# EAGLE schematic TRIWHEEL (EAGLE 9.5.1)
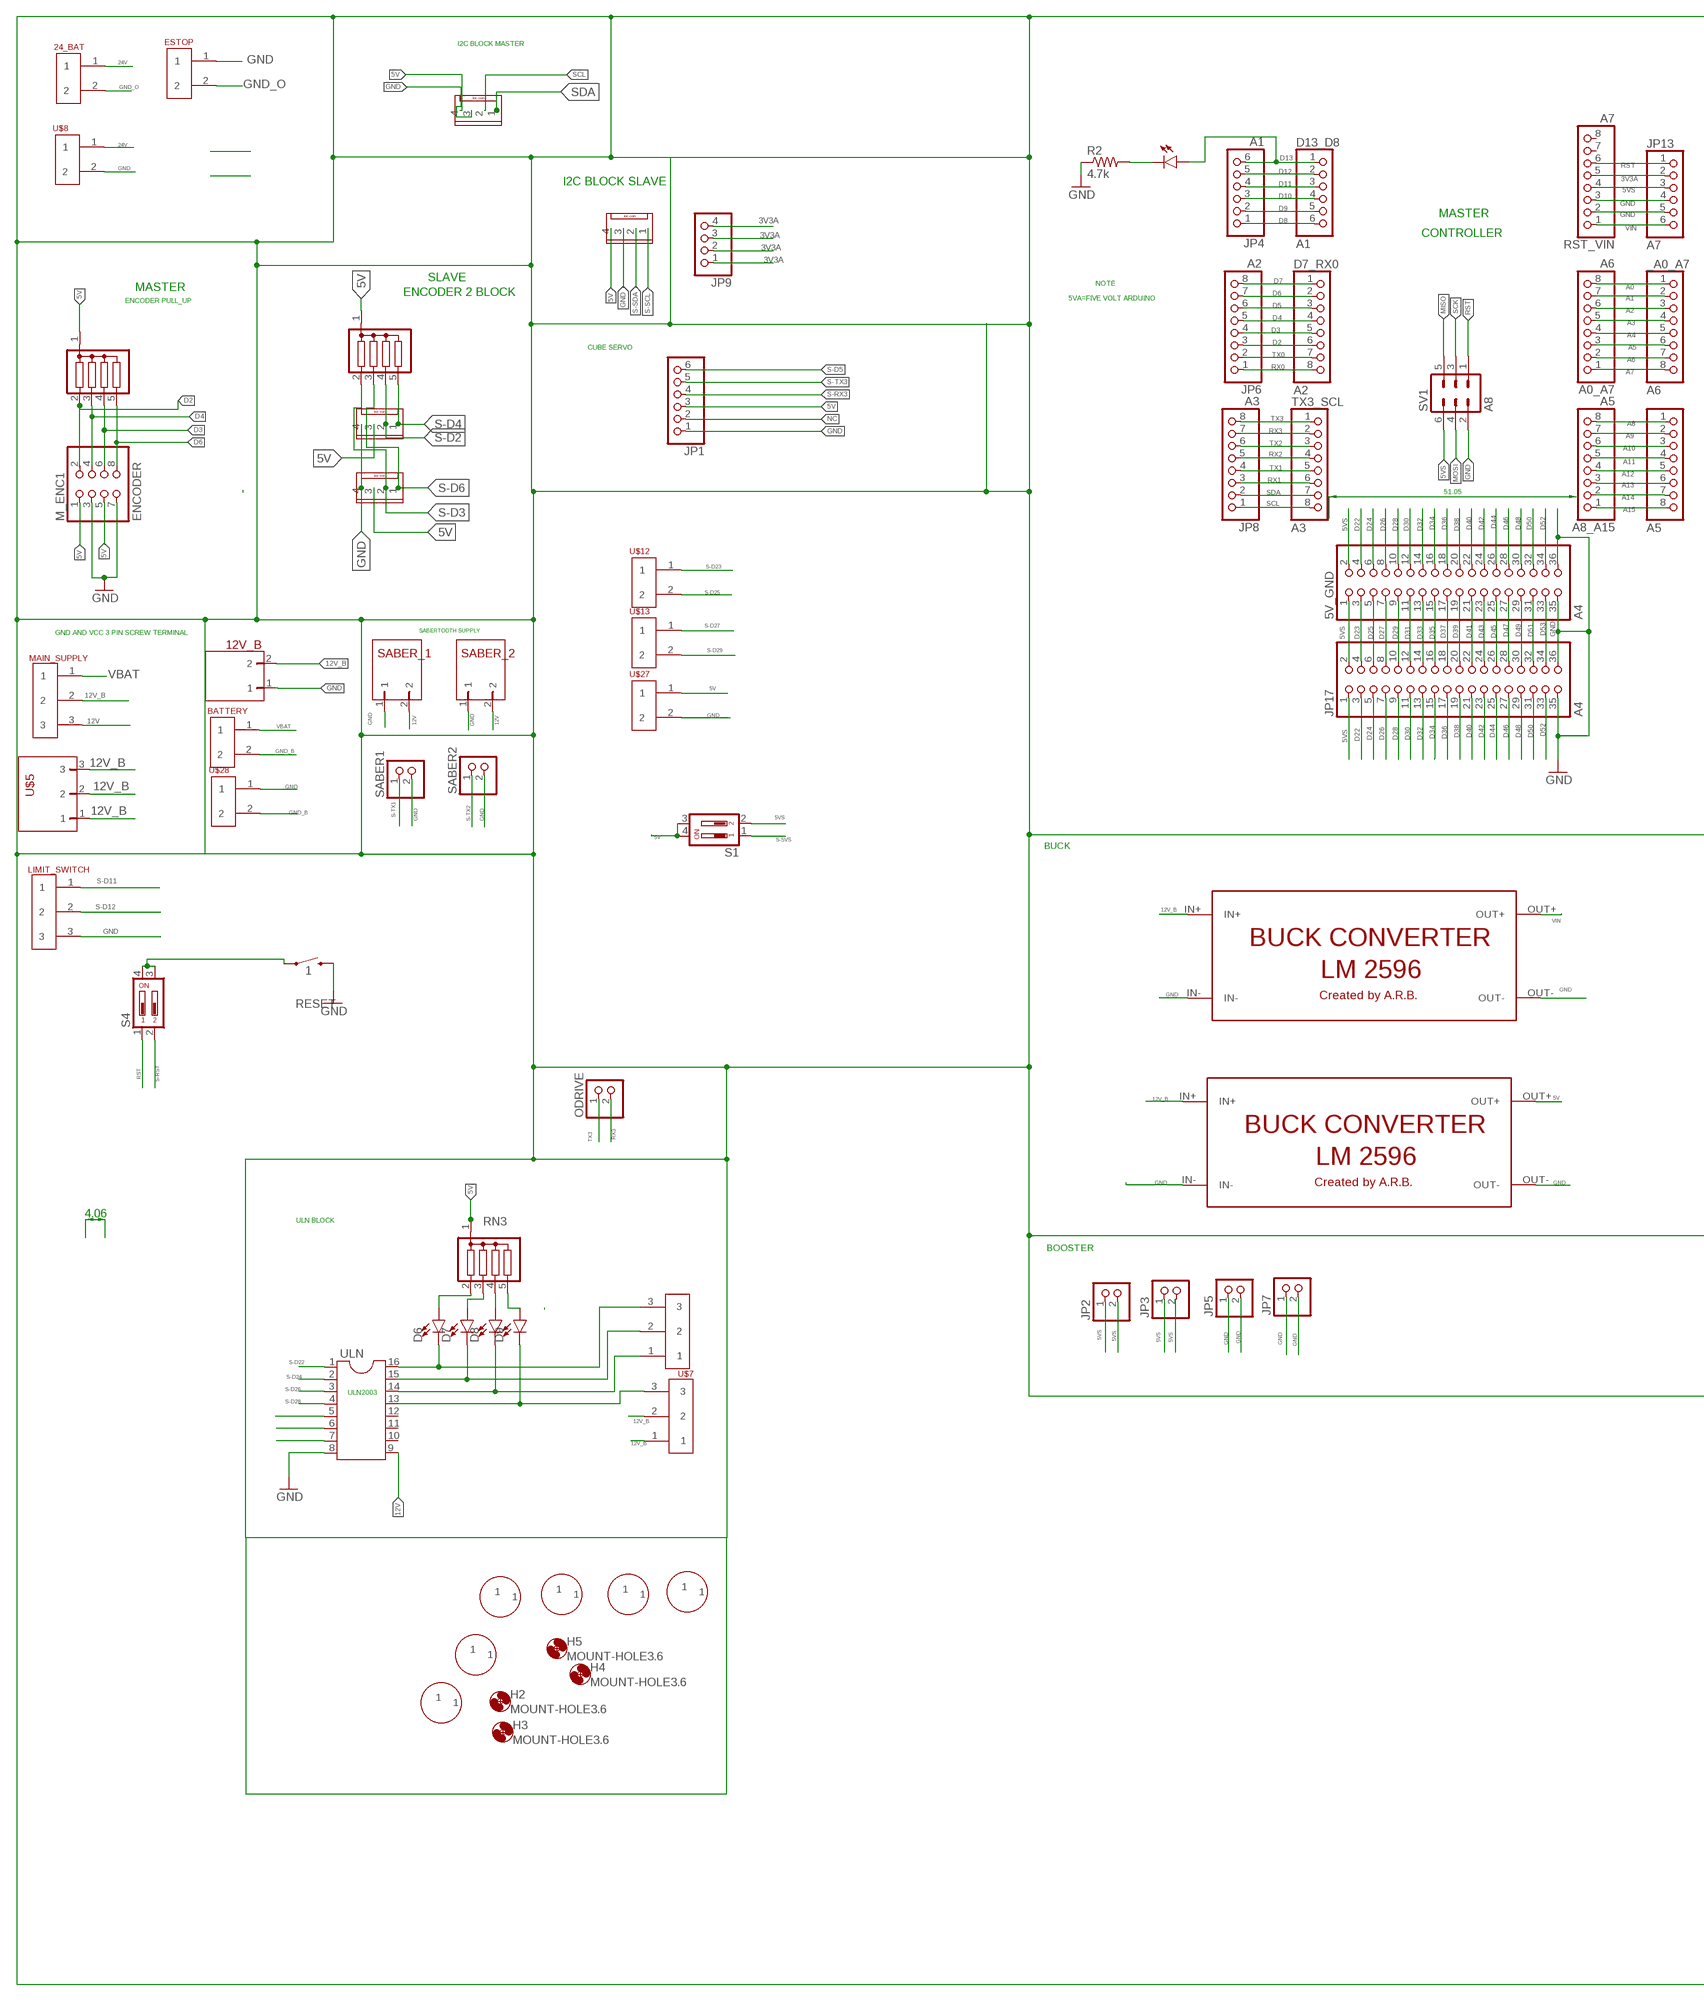
[diagram p0: schematic, sheet 1, part 1 of 2]
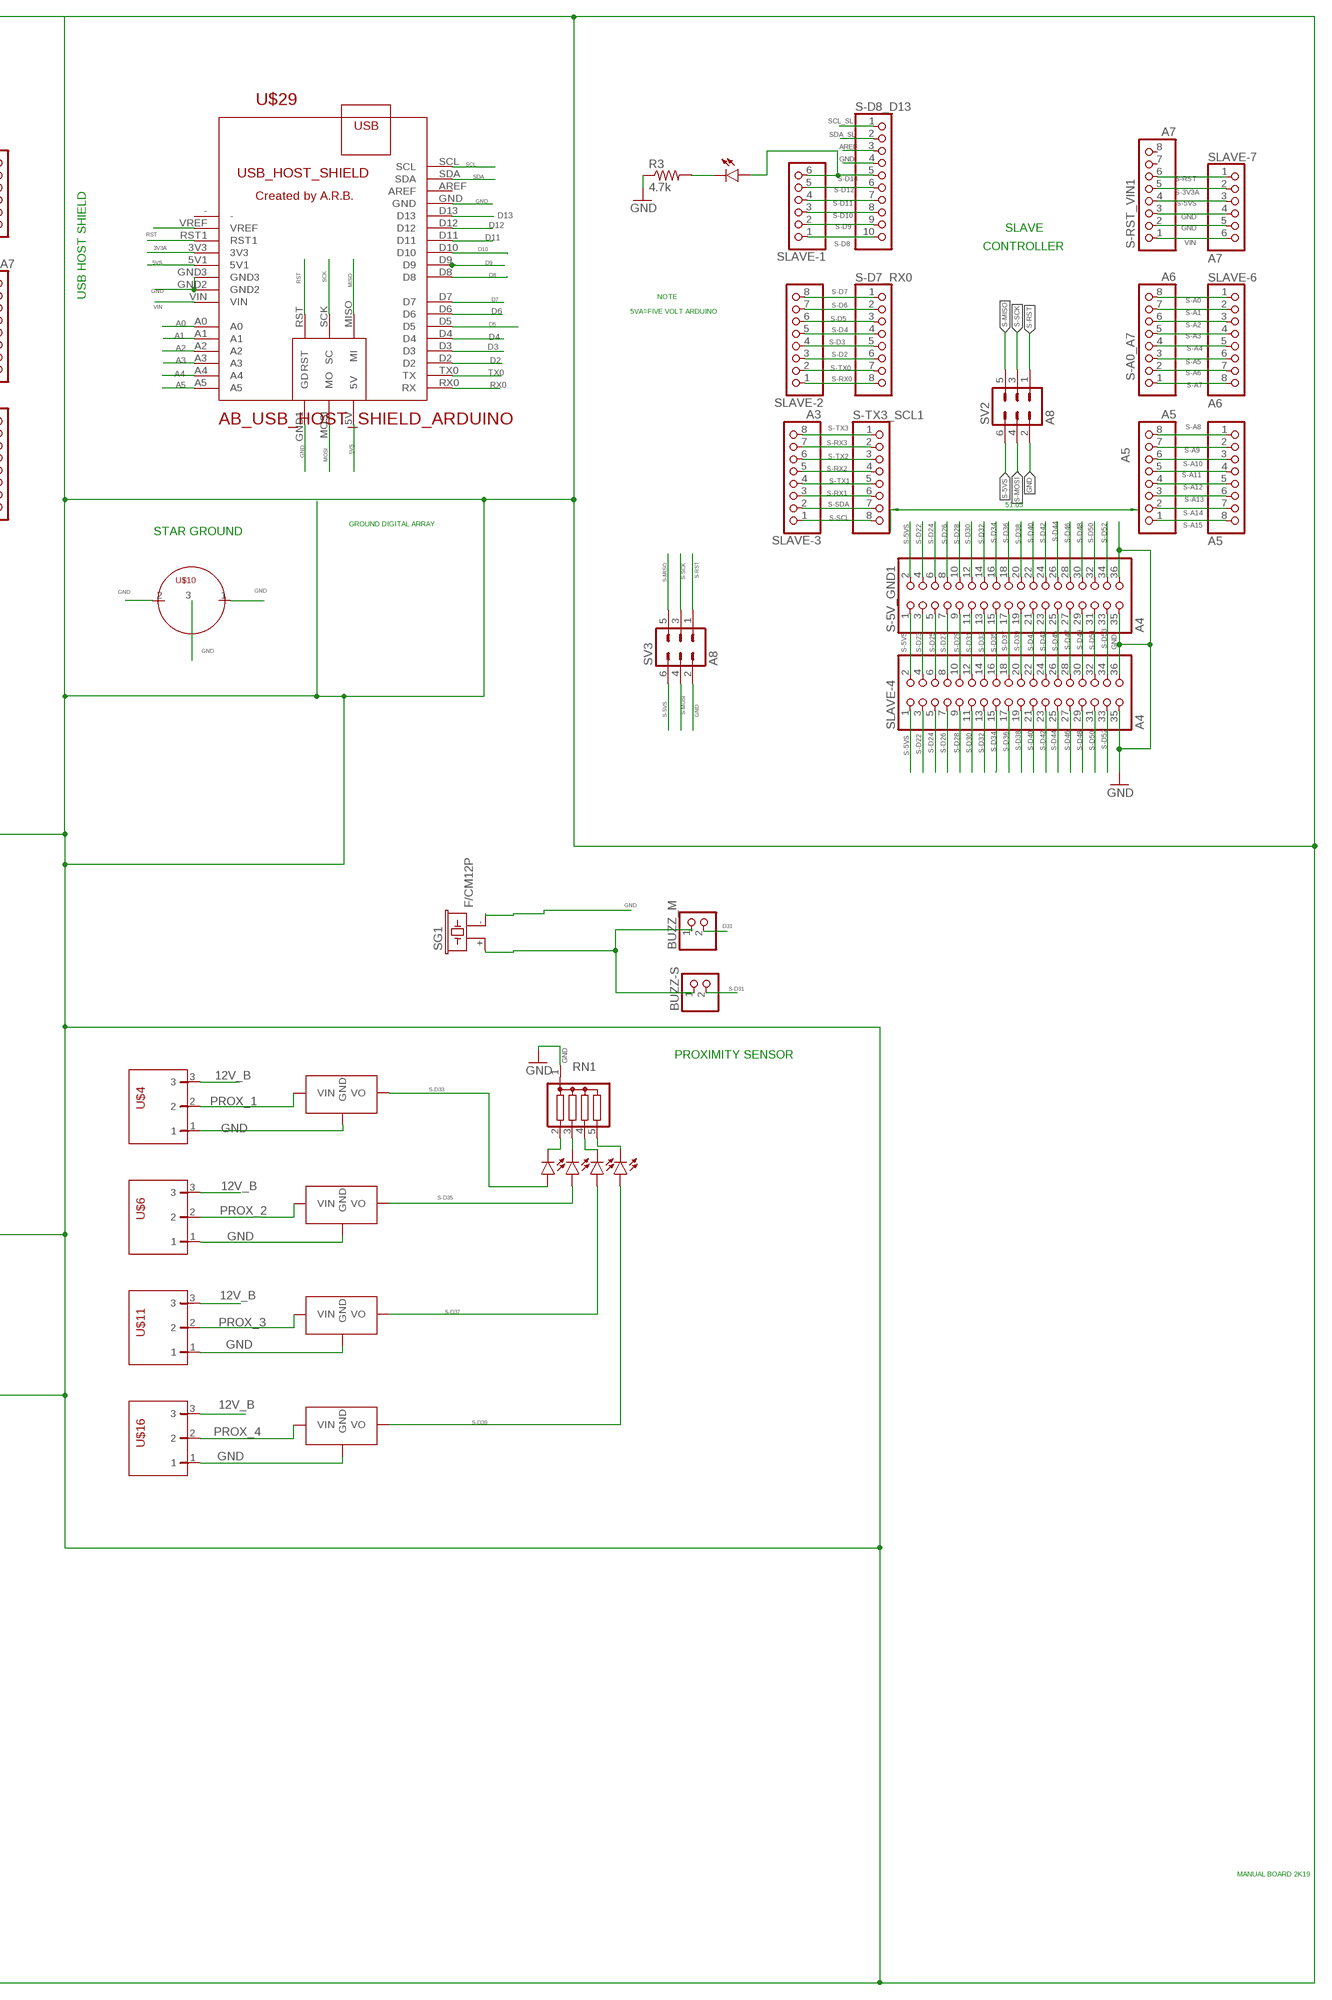
[diagram p1: schematic, sheet 1, part 2 of 2]

## Parts
5V_GND  A4  PINHD-2X18  [2X18]
12V_B  AB_RIGHT_TER_BLK  [AB_RIGHT_TER_BLK]
24_BAT  AB_SCREW_TERMINAL_5MM_2PIN  [AB_SCREW_TERMINAL_5MM_2PIN]
_A0_A7  A6  PINHD-1X8  [1X08]
A0_A7  A6  PINHD-1X8  [1X08]
A5  A5  PINHD-1X8  [1X08]
A8_A15  A5  PINHD-1X8  [1X08]
BATTERY  AB_SCREW_TERMINAL_5MM_2PIN  [AB_SCREW_TERMINAL_5MM_2PIN]
BUZZ-S  PINHD-1X2  [1X02]
BUZZ_M  PINHD-1X2  [1X02]
D1  LED-3MM-NO_SILK  [LED_3MM-NS]
D2  LED-3MM-NO_SILK  [LED_3MM-NS]
D3  LED-3MM-NO_SILK  [LED_3MM-NS]
D4  LED-3MM-NO_SILK  [LED_3MM-NS]
D5  LED-3MM-NO_SILK  [LED_3MM-NS]
D6  LED-3MM-NO_SILK  [LED_3MM-NS]
D7  LED-3MM-NO_SILK  [LED_3MM-NS]
D7_RX0  A2  PINHD-1X8  [1X08]
D8  LED-3MM-NO_SILK  [LED_3MM-NS]
D9  LED-3MM-NO_SILK  [LED_3MM-NS]
D13  LED-3MM-NO_SILK  [LED_3MM-NS]
D13_D8  A1  PINHD-1X6  [1X06]
ESTOP  AB_SCREW_TERMINAL_5MM_2PIN  [AB_SCREW_TERMINAL_5MM_2PIN]
H2  MOUNT-HOLE3.6  [3,6]
H3  MOUNT-HOLE3.6  [3,6]
H4  MOUNT-HOLE3.6  [3,6]
H5  MOUNT-HOLE3.6  [3,6]
IMU_BLOCK  AB_4PIN_LOC_CONNECTOR  [AB_4PIN_LOC_CONNECTOR]
IMU_BLOCK-M  AB_4PIN_LOC_CONNECTOR  [AB_4PIN_LOC_CONNECTOR]
JP  A5  PINHD-1X8  [1X08]
JP1  PINHD-1X6  [1X06]
JP2  PINHD-1X2  [1X02]
JP3  PINHD-1X2  [1X02]
JP4  A1  PINHD-1X6  [1X06]
JP5  PINHD-1X2  [1X02]
JP6  A2  PINHD-1X8  [1X08]
JP7  PINHD-1X2  [1X02]
JP8  A3  PINHD-1X8  [1X08]
JP9  PINHD-1X4  [1X04]
JP13  A7  PINHD-1X6  [1X06]
JP17  A4  PINHD-2X18  [2X18]
LIMIT_SWITCH  AB_SCREW_TER_5MM_3PIN  [AB_SCREW_TER_5MM_3PIN]
M_ENC1  ENCODER  PINHD-2X4  [2X04]
MAIN_SUPPLY  AB_SCREW_TER_5MM_3PIN  [AB_SCREW_TER_5MM_3PIN]
MAIN_SUPPLY1  AB_SCREW_TER_5MM_3PIN  [AB_SCREW_TER_5MM_3PIN]
ODRIVE  PINHD-1X2  [1X02]
PULL_RESISTOR-M  G04R  [SIL5]
R2  4.7k  R-US_0204/7  [0204/7]
R3  4.7k  R-US_0204/7  [0204/7]
RESET  1  MOMENTARY-SWITCH-SPST-PTH-6.0MM  [TACTILE_SWITCH_PTH_6.0MM]
RN1  G04R  [SIL5]
RN3  G04R  [SIL5]
RST_VIN  A7  PINHD-1X8  [1X08]
S1  DIP02YL  [DIP02YL]
S4  DIP02YL  [DIP02YL]
S-5V_GND1  A4  PINHD-2X18  [2X18]
S-A0_A7  A6  PINHD-1X8  [1X08]
S-D7_RX0  A2  PINHD-1X8  [1X08]
S-D8_D13  PINHD-1X10  [1X10]
S-ENC  G04R  [SIL5]
S-RST_VIN1  A7  PINHD-1X8  [1X08]
S-TX3_SCL1  A3  PINHD-1X8  [1X08]
S_A8_A15  A5  PINHD-1X8  [1X08]
SABER1  PINHD-1X2  [1X02]
SABER2  PINHD-1X2  [1X02]
SABER_1  AB_RIGHT_TER_BLK  [AB_RIGHT_TER_BLK]
SABER_2  AB_RIGHT_TER_BLK  [AB_RIGHT_TER_BLK]
SG1  F/CM12P  [F/CM12P]
SLAVE-1  A1  PINHD-1X6  [1X06]
SLAVE-2  A2  PINHD-1X8  [1X08]
SLAVE-3  A3  PINHD-1X8  [1X08]
SLAVE-4  A4  PINHD-2X18  [2X18]
SLAVE-6  A6  PINHD-1X8  [1X08]
SLAVE-7  A7  PINHD-1X6  [1X06]
SV1  A8  MA03-2  [MA03-2]
SV2  A8  MA03-2  [MA03-2]
SV3  A8  MA03-2  [MA03-2]
TX3_SCL  A3  PINHD-1X8  [1X08]
U$1  AB_LM2596_BUCK_CONVERTER  [AB_LM2596_BUCK_CONVERTER]
U$2  AB_LM2596_BUCK_CONVERTER  [AB_LM2596_BUCK_CONVERTER]
U$4  AB_RIGHT_TER_BLK_3PIN  [AB_RIGHT_TER_BLK_3PIN]
U$5  AB_RIGHT_TER_BLK_3PIN  [AB_RIGHT_TER_BLK_3PIN]
U$6  AB_RIGHT_TER_BLK_3PIN  [AB_RIGHT_TER_BLK_3PIN]
U$7  AB_SCREW_TER_5MM_3PIN  [AB_SCREW_TER_5MM_3PIN]
U$8  AB_SCREW_TERMINAL_5MM_2PIN  [AB_SCREW_TERMINAL_5MM_2PIN]
U$9  AB_PLATED_DRILL_160MIL  [AB_PLATED_DRILL_160MIL]
U$10  AB_JOINT_GND  [AB_JOINT_GND]
U$11  AB_RIGHT_TER_BLK_3PIN  [AB_RIGHT_TER_BLK_3PIN]
U$12  AB_SCREW_TERMINAL_5MM_2PIN  [AB_SCREW_TERMINAL_5MM_2PIN]
U$13  AB_SCREW_TERMINAL_5MM_2PIN  [AB_SCREW_TERMINAL_5MM_2PIN]
U$15  AB_PLATED_DRILL_160MIL  [AB_PLATED_DRILL_160MIL]
U$16  AB_RIGHT_TER_BLK_3PIN  [AB_RIGHT_TER_BLK_3PIN]
U$17  AB_7805_FLAT  [AB_7805_FLAT]
U$18  AB_7805_FLAT  [AB_7805_FLAT]
U$19  AB_7805_FLAT  [AB_7805_FLAT]
U$20  AB_7805_FLAT  [AB_7805_FLAT]
U$21  en1  AB_4PIN_LOC_CONNECTOR  [AB_4PIN_LOC_CONNECTOR]
U$22  en2  AB_4PIN_LOC_CONNECTOR  [AB_4PIN_LOC_CONNECTOR]
U$23  AB_PLATED_DRILL_160MIL  [AB_PLATED_DRILL_160MIL]
U$24  AB_PLATED_DRILL_160MIL  [AB_PLATED_DRILL_160MIL]
U$25  AB_PLATED_DRILL_160MIL  [AB_PLATED_DRILL_160MIL]
U$26  AB_PLATED_DRILL_160MIL  [AB_PLATED_DRILL_160MIL]
U$27  AB_SCREW_TERMINAL_5MM_2PIN  [AB_SCREW_TERMINAL_5MM_2PIN]
U$28  AB_SCREW_TERMINAL_5MM_2PIN  [AB_SCREW_TERMINAL_5MM_2PIN]
U$29  AB_USB_HOST_SHIELD_ARDUINO  [AB_USB_HOST_SHIELD_ARDUINO]
ULN  DIL16  [DIL16]

## Nets
3V3A [nrf]: JP9.1 JP9.2 JP9.3 JP9.4 JP13.2 RST_VIN.5 U$29.3V3
5V [5v]: IMU_BLOCK-M.4 IMU_BLOCK.4 JP1.3 M_ENC1.1 M_ENC1.5 PULL_RESISTOR-M.1 RN3.1 S1.3 S1.4 S-ENC.1 U$2.OUT+ U$21.3 U$22.3 U$27.1
5VS [signal]: 5V_GND.1 5V_GND.2 JP2.1 JP2.2 JP3.1 JP3.2 JP13.3 JP17.1 JP17.2 RST_VIN.4 S1.2 SV1.6 U$29.5V U$29.5V1
12V: MAIN_SUPPLY.3 SABER_1.2 SABER_2.2 ULN.9
12V_B: 12V_B.2 MAIN_SUPPLY1.1 MAIN_SUPPLY1.2 MAIN_SUPPLY.2 U$1.IN+ U$2.IN+ U$4.3 U$5.1 U$5.2 U$5.3 U$6.3 U$11.3 U$16.3
24V: 24_BAT.1 U$8.1
A0 [arduino]: _A0_A7.1 A0_A7.8 U$29.A0
A1 [arduino]: _A0_A7.2 A0_A7.7 U$29.A1
A2 [arduino]: _A0_A7.3 A0_A7.6 U$29.A2
A3 [arduino]: _A0_A7.4 A0_A7.5 U$29.A3
A4 [arduino]: _A0_A7.5 A0_A7.4 U$29.A4
A5 [arduino]: _A0_A7.6 A0_A7.3 U$29.A5
A6 [arduino]: _A0_A7.7 A0_A7.2
A7 [arduino]: _A0_A7.8 A0_A7.1
A8 [arduino]: A8_A15.8 JP.1
A9 [arduino]: A8_A15.7 JP.2
A10 [arduino]: A8_A15.6 JP.3
A11 [arduino]: A8_A15.5 JP.4
A12 [arduino]: A8_A15.4 JP.5
A13 [arduino]: A8_A15.3 JP.6
A14 [arduino]: A8_A15.2 JP.7
A15 [arduino]: A8_A15.1 JP.8
AREF [signal-2]: S-D8_D13.3
D2 [arduino]: D7_RX0.6 JP6.3 M_ENC1.2 PULL_RESISTOR-M.2 U$29.D2
D3 [arduino]: D7_RX0.5 JP6.4 M_ENC1.6 PULL_RESISTOR-M.4 U$29.D3
D4 [arduino]: D7_RX0.4 JP6.5 M_ENC1.4 PULL_RESISTOR-M.3 U$29.D4
D5 [arduino]: D7_RX0.3 JP6.6 U$29.D5
D6 [arduino]: D7_RX0.2 JP6.7 M_ENC1.8 PULL_RESISTOR-M.5 U$29.D6
D7 [arduino]: D7_RX0.1 JP6.8 U$29.D7
D8 [arduino]: D13_D8.6 JP4.1 U$29.D8
D9 [arduino]: D13_D8.5 JP4.2 U$29.D9
D10 [arduino]: D13_D8.4 JP4.3 U$29.D10
D11 [arduino]: D13_D8.3 JP4.4 U$29.D11
D12 [arduino]: D13_D8.2 JP4.5 U$29.D12
D13 [arduino]: D13.A D13_D8.1 JP4.6 U$29.D13
D22 [signal]: 5V_GND.4 JP17.3
D23 [arduino]: 5V_GND.3 JP17.4
D24 [signal]: 5V_GND.6 JP17.5
D25 [signal]: 5V_GND.5 JP17.6
D26 [signal]: 5V_GND.8 JP17.7
D27 [signal]: 5V_GND.7 JP17.8
D28 [signal]: 5V_GND.10 JP17.9
D29 [arduino]: 5V_GND.9 JP17.10
D30 [signal]: 5V_GND.12 JP17.11
D31 [arduino]: 5V_GND.11 BUZZ_M.2 JP17.12
D32 [signal]: 5V_GND.14 JP17.13
D33 [arduino]: 5V_GND.13 JP17.14
D34 [signal]: 5V_GND.16 JP17.15
D35 [arduino]: 5V_GND.15 JP17.16
D36 [signal]: 5V_GND.18 JP17.17
D37 [arduino]: 5V_GND.17 JP17.18
D38 [signal]: 5V_GND.20 JP17.19
D39 [arduino]: 5V_GND.19 JP17.20
D40 [signal]: 5V_GND.22 JP17.21
D41 [arduino]: 5V_GND.21 JP17.22
D42 [signal]: 5V_GND.24 JP17.23
D43 [arduino]: 5V_GND.23 JP17.24
D44 [signal]: 5V_GND.26 JP17.25
D45 [arduino]: 5V_GND.25 JP17.26
D46 [signal]: 5V_GND.28 JP17.27
D47 [arduino]: 5V_GND.27 JP17.28
D48 [signal]: 5V_GND.30 JP17.29
D49 [signal]: 5V_GND.29 JP17.30
D50 [signal]: 5V_GND.32 JP17.31
D51 [signal]: 5V_GND.31 JP17.32
D52 [signal]: 5V_GND.34 JP17.33
D53 [signal]: 5V_GND.33 JP17.34
GND: 5V_GND.35 5V_GND.36 12V_B.1 ESTOP.1 IMU_BLOCK-M.3 IMU_BLOCK.3 JP1.1 JP5.1 JP5.2 JP7.1 JP7.2 JP13.4 JP13.5 JP17.35 JP17.36 LIMIT_SWITCH.3 M_ENC1.3 M_ENC1.7 R2.1 R3.1 RESET.3 RN1.1 RST_VIN.2 RST_VIN.3 S-5V_GND1.35 S-5V_GND1.36 S-D8_D13.4 S-RST_VIN1.2 S-RST_VIN1.3 SABER1.2 SABER2.2 SABER_1.1 SABER_2.1 SG1.- SLAVE-4.35 SLAVE-4.36 SLAVE-7.4 SLAVE-7.5 SV1.2 SV2.2 SV3.2 U$1.IN- U$1.OUT- U$2.IN- U$2.OUT- U$4.1 U$6.1 U$8.2 U$10.1 U$10.2 U$10.3 U$11.1 U$16.1 U$17.2(GND) U$18.2(GND) U$19.2(GND) U$20.2(GND) U$21.4 U$22.4 U$27.2 U$28.1 U$29.GND U$29.GND1(GD) U$29.GND2 U$29.GND3 ULN.8
GND_B: BATTERY.2 U$28.2
GND_O [odrive]: 24_BAT.2 ESTOP.2
MISO [signal]: SV1.5 U$29.MISO(MI)
MOSI [signal]: SV1.4 U$29.MOSI(MO)
N$2: D5.K(C) R3.2
N$3 [signal-3]: BUZZ-S.1 BUZZ_M.1 SG1.+
N$5: D1.K(C) RN1.2
N$6: D2.K(C) RN1.3
N$7 [signal-3]: D6.K(C) U$7.3 ULN.16
N$8 [signal-3]: D7.K(C) U$7.2 ULN.15
N$9 [signal-3]: D8.K(C) U$7.1 ULN.14
N$10 [signal-3]: D9.K(C) MAIN_SUPPLY1.3 ULN.13
N$12 [signal-1]: D6.A RN3.2
N$13 [signal-1]: D7.A RN3.3
N$14 [signal-1]: D8.A RN3.4
N$15 [signal-1]: D9.A RN3.5
N$16 [signal-3]: RESET.1 S4.3 S4.4
N$19: U$29.VREF
N$20: D3.K(C) RN1.4
N$21: D4.K(C) RN1.5
N$32 [signal-1]: ULN.5
N$33 [signal-1]: ULN.6
N$34 [signal-1]: ULN.7
N$140 [signal]: D13.K(C) R2.2
NC: JP1.2
PROX_1: U$4.2 U$17.1(VIN)
PROX_2: U$6.2 U$18.1(VIN)
PROX_3: U$11.2 U$19.1(VIN)
PROX_4: U$16.2 U$20.1(VIN)
RST [arduino]: JP13.1 RST_VIN.6 S4.1 SV1.1 U$29.RST U$29.RST1
RX0 [arduino]: D7_RX0.8 JP6.1 U$29.RX0(RX)
RX1 [arduino]: JP8.3 TX3_SCL.6
RX2 [arduino]: JP8.5 TX3_SCL.4
RX3 [arduino]: JP8.7 ODRIVE.2 TX3_SCL.2
S-3V3A [signal-2]: S-RST_VIN1.5 SLAVE-7.2
S-5VS [signal-2]: S1.1 S-5V_GND1.1 S-5V_GND1.2 S-RST_VIN1.4 SLAVE-4.1 SLAVE-4.2 SLAVE-7.3 SV2.6 SV3.6
S-A0 [signal-2]: S-A0_A7.8 SLAVE-6.1
S-A1 [signal-2]: S-A0_A7.7 SLAVE-6.2
S-A2 [signal-2]: S-A0_A7.6 SLAVE-6.3
S-A3 [signal-2]: S-A0_A7.5 SLAVE-6.4
S-A4 [signal-2]: S-A0_A7.4 SLAVE-6.5
S-A5 [signal-2]: S-A0_A7.3 SLAVE-6.6
S-A6 [signal-2]: S-A0_A7.2 SLAVE-6.7
S-A7 [signal-2]: S-A0_A7.1 SLAVE-6.8
S-A8 [signal-2]: A5.8 S_A8_A15.1
S-A9 [signal-2]: A5.7 S_A8_A15.2
S-A10 [signal-2]: A5.6 S_A8_A15.3
S-A11 [signal-2]: A5.5 S_A8_A15.4
S-A12 [signal-2]: A5.4 S_A8_A15.5
S-A13 [signal-2]: A5.3 S_A8_A15.6
S-A14 [signal-2]: A5.2 S_A8_A15.7
S-A15 [signal-2]: A5.1 S_A8_A15.8
S-D2 [signal-2]: S-D7_RX0.6 S-ENC.4 SLAVE-2.3 U$21.2
S-D3 [signal-2]: S-D7_RX0.5 S-ENC.2 SLAVE-2.4 U$22.2
S-D4 [signal-2]: S-D7_RX0.4 S-ENC.5 SLAVE-2.5 U$21.1
S-D5 [signal-2]: JP1.6 S-D7_RX0.3 SLAVE-2.6
S-D6 [signal-2]: S-D7_RX0.2 S-ENC.3 SLAVE-2.7 U$22.1
S-D7 [signal-2]: S-D7_RX0.1 SLAVE-2.8
S-D8 [signal-2]: S-D8_D13.10 SLAVE-1.1
S-D9 [signal-2]: S-D8_D13.9 SLAVE-1.2
S-D10 [signal-2]: S-D8_D13.8 SLAVE-1.3
S-D11 [signal-2]: LIMIT_SWITCH.1 S-D8_D13.7 SLAVE-1.4
S-D12 [signal-2]: LIMIT_SWITCH.2 S-D8_D13.6 SLAVE-1.5
S-D13 [signal-2]: D5.A S-D8_D13.5 SLAVE-1.6
S-D22 [signal-2]: S-5V_GND1.4 SLAVE-4.3 ULN.1
S-D23 [signal-2]: S-5V_GND1.3 SLAVE-4.4 U$12.1
S-D24 [signal-2]: S-5V_GND1.6 SLAVE-4.5 ULN.2
S-D25 [signal-2]: S-5V_GND1.5 SLAVE-4.6 U$12.2
S-D26 [signal-2]: S-5V_GND1.8 SLAVE-4.7 ULN.3
S-D27 [signal-2]: S-5V_GND1.7 SLAVE-4.8 U$13.1
S-D28 [signal-2]: S-5V_GND1.10 SLAVE-4.9 ULN.4
S-D29 [signal-2]: S-5V_GND1.9 SLAVE-4.10 U$13.2
S-D30 [signal-2]: S-5V_GND1.12 SLAVE-4.11
S-D31 [signal-2]: BUZZ-S.2 S-5V_GND1.11 SLAVE-4.12
S-D32 [signal-2]: S-5V_GND1.14 SLAVE-4.13
S-D33 [signal-2]: D1.A S-5V_GND1.13 SLAVE-4.14 U$17.3(VO)
S-D34 [signal-2]: S-5V_GND1.16 SLAVE-4.15
S-D35 [signal-2]: D2.A S-5V_GND1.15 SLAVE-4.16 U$18.3(VO)
S-D36 [signal-2]: S-5V_GND1.18 SLAVE-4.17
S-D37 [signal-2]: D3.A S-5V_GND1.17 SLAVE-4.18 U$19.3(VO)
S-D38 [signal-2]: S-5V_GND1.20 SLAVE-4.19
S-D39 [signal-2]: D4.A S-5V_GND1.19 SLAVE-4.20 U$20.3(VO)
S-D40 [signal-2]: S-5V_GND1.22 SLAVE-4.21
S-D41 [signal-2]: S-5V_GND1.21 SLAVE-4.22
S-D42 [signal-2]: S-5V_GND1.24 SLAVE-4.23
S-D43 [signal-2]: S-5V_GND1.23 SLAVE-4.24
S-D44 [signal-2]: S-5V_GND1.26 SLAVE-4.25
S-D45 [signal-2]: S-5V_GND1.25 SLAVE-4.26
S-D46 [signal-2]: S-5V_GND1.28 SLAVE-4.27
S-D47 [signal-2]: S-5V_GND1.27 SLAVE-4.28
S-D48 [signal-2]: S-5V_GND1.30 SLAVE-4.29
S-D49 [signal-2]: S-5V_GND1.29 SLAVE-4.30
S-D50 [signal-2]: S-5V_GND1.32 SLAVE-4.31
S-D51 [signal-2]: S-5V_GND1.31 SLAVE-4.32
S-D52 [signal-2]: S-5V_GND1.34 SLAVE-4.33
S-D53 [signal-2]: S-5V_GND1.33 SLAVE-4.34
S-MISO [signal-2]: SV2.5 SV3.5
S-MOSI [signal-2]: SV2.4 SV3.4
S-RST [signal-2]: S4.2 S-RST_VIN1.6 SLAVE-7.1 SV2.1 SV3.1
S-RX0 [signal-2]: S-D7_RX0.8 SLAVE-2.1
S-RX1 [signal-2]: S-TX3_SCL1.6 SLAVE-3.3
S-RX2 [signal-2]: S-TX3_SCL1.4 SLAVE-3.5
S-RX3 [signal-2]: JP1.4 S-TX3_SCL1.2 SLAVE-3.7
S-SCK [signal-2]: SV2.3 SV3.3
S-SCL [signal-2]: IMU_BLOCK.1 S-TX3_SCL1.8 SLAVE-3.1
S-SDA [signal-2]: IMU_BLOCK.2 S-TX3_SCL1.7 SLAVE-3.2
S-TX0 [signal-2]: S-D7_RX0.7 SLAVE-2.2
S-TX1 [signal-2]: S-TX3_SCL1.5 SABER1.1 SLAVE-3.4
S-TX2 [signal-2]: S-TX3_SCL1.3 SABER2.1 SLAVE-3.6
S-TX3 [signal-2]: JP1.5 S-TX3_SCL1.1 SLAVE-3.8
SCK [signal]: SV1.3 U$29.SCK(SC)
SCL [arduino]: IMU_BLOCK-M.2 JP8.1 TX3_SCL.8 U$29.SCL
SCL_SL [signal-2]: S-D8_D13.1
SDA [arduino]: IMU_BLOCK-M.1 JP8.2 TX3_SCL.7 U$29.SDA
SDA_SL [signal-2]: S-D8_D13.2
TX0 [arduino]: D7_RX0.7 JP6.2 U$29.TX0(TX)
TX1 [arduino]: JP8.4 TX3_SCL.5
TX2 [arduino]: JP8.6 TX3_SCL.3
TX3 [arduino]: JP8.8 ODRIVE.1 TX3_SCL.1
VBAT: BATTERY.1 MAIN_SUPPLY.1
VIN [arduino]: JP13.6 RST_VIN.1 S-RST_VIN1.1 SLAVE-7.6 U$1.OUT+ U$29.VIN
Unconnected: RST_VIN.7 RST_VIN.8 S-RST_VIN1.7 S-RST_VIN1.8 U$9.1 U$15.1 U$23.1 U$24.1 U$25.1 U$26.1 U$29.- U$29.AREF ULN.10 ULN.11 ULN.12

## Notes on the sheet
- I2C BLOCK MASTER
- I2C BLOCK SLAVE
- MASTER
- SLAVE
- CONTROLLER
- CONTROLLER
- SLAVE
- NOTE
- MASTER
- ENCODER 2 BLOCK
- 5VA=FIVE VOLT ARDUINO | USB HOST SHIELD | NOTE
- ENCODER PULL_UP
- 5VA=FIVE VOLT ARDUINO
- CUBE SERVO
- GROUND DIGITAL ARRAY
- STAR GROUND
- SABERTOOTH SUPPLY
- GND AND VCC 3 PIN SCREW TERMINAL
- BUCK
- PROXIMITY SENSOR
- ULN BLOCK
- BOOSTER
- ULN2003
- MANUAL BOARD 2K19

## Library data of the parts
5V_GND JP17 S-5V_GND1 SLAVE-4 = pinhead:PINHD-2X18: PIN HEADER
12V_B SABER_1 SABER_2 = AB_Right_angle_terminal_block:AB_RIGHT_TER_BLK
24_BAT BATTERY ESTOP U$8 U$12 U$13 U$27 U$28 = AB_SCREW_TER_5MM_2PIN_BIG:AB_SCREW_TERMINAL_5MM_2PIN
_A0_A7 A0_A7 A5 A8_A15 D7_RX0 JP JP6 JP8 RST_VIN S-A0_A7 S-D7_RX0 S-RST_VIN1 S-TX3_SCL1 S_A8_A15 SLAVE-2 SLAVE-3 SLAVE-6 TX3_SCL = pinhead:PINHD-1X8: PIN HEADER
BUZZ-S BUZZ_M JP2 JP3 JP5 JP7 ODRIVE SABER1 SABER2 = pinhead:PINHD-1X2: PIN HEADER
D1-D9 D13 = SparkFun-LED:LED: LED (Generic) Standard schematic elements and footprints for 5mm, 3mm, 1206, and 0603 sized LEDs. Generic LEDs with no color specified.
D13_D8 JP1 JP4 JP13 SLAVE-1 SLAVE-7 = pinhead:PINHD-1X6: PIN HEADER
H2-H5 = holes:MOUNT-HOLE: MOUNTING HOLE with drill center marker
IMU_BLOCK IMU_BLOCK-M U$21 U$22 = AB_LOCKING CONNECTORS:AB_4PIN_LOC_CONNECTOR
JP9 = pinhead:PINHD-1X4: PIN HEADER
LIMIT_SWITCH MAIN_SUPPLY MAIN_SUPPLY1 U$7 = AB_SCREW_TER_5MM_3PIN_BIG:AB_SCREW_TER_5MM_3PIN
M_ENC1 = pinhead:PINHD-2X4: PIN HEADER
PULL_RESISTOR-M RN1 RN3 S-ENC = resistor-sil:G04R: SIL RESISTOR; OC_FARNELL: unknown; OC_NEWARK: unknown
R2 R3 = adafruit:R-US_: RESISTOR, American symbol
RESET = SparkFun-Switches:MOMENTARY-SWITCH-SPST: Momentary Switch (Pushbutton) - SPST Normally-open (NO) SPST momentary switches (buttons, pushbuttons). Variants PTH-12MM - 12mm square, through-hole Momentary Pushbutton Switch - 12mm Square <https://www.sparkfun.com/products/9190> (COM-09190) PTH-6.0MM, PTH-6.0MM-KIT - 6.0mm square, through-hole Mini Pushbutton Switch <https://www.sparkfun.com/products/97> (COM-00097) KIT package intended for soldering kit's - only one side of pads' copper is exposed. PTH-RIGHT-ANGLE-KIT - Right-angle, through-hole Right Angle Tactile Button <https://www.sparkfun.com/products/10791> - Used on SparkFun BigTime Watch Kit <https://www.sparkfun.com/products/11734> SMD-12MM - 12mm square, surface-mount Tactile Button - SMD (12mm) <https://www.sparkfun.com/products/12993> (COM-12993) Used on SparkFun PicoBoard <https://www.sparkfun.com/products/11888> SMD-4.5MM - 4.5mm Square Trackball Switch Used on SparkFun Blackberry Trackballer Breakout <https://www.sparkfun.com/products/13169> SMD-4.6MMX2.8MM - 4.60mm x 2.80mm, surface mount Used on SparkFun SAMD21 Mini Breakout <https://www.sparkfun.com/products/13664> SMD-5.2MM, SMD-5.2-REDUNDANT - 5.2mm square, surface-mount Mini Pushbutton Switch - SMD <https://www.sparkfun.com/products/8720> (COM-08720) Used on Arduino Pro Mini <https://www.sparkfun.com/products/11114> REDUNDANT package connects both switch circuits together SMD-6.0X3.5MM - 6.0 x 3.5mm, surface mount Momentary Reset Switch SMD <https://www.sparkfun.com/products/8229> (COM-08229) SMD-6.2MM-TALL - 6.2mm square, surface mount Tactile Button - SMD (6mm) <https://www.sparkfun.com/products/12992> Used on SparkFun Digital Sandbox <https://www.sparkfun.com/products/12651> SMD-RIGHT-ANGLE - Right-angle, surface mount Used on SparkFun Block for Intel® Edison - Arduino <https://www.sparkfun.com/products/13036>; PROD_ID: SWCH-08441; SF_SKU: COM-00097
S1 S4 = switch-dil:DIP02YL: DIL/CODE SWITCH; OC_FARNELL: unknown; OC_NEWARK: unknown
S-D8_D13 = pinhead:PINHD-1X10: PIN HEADER
SG1 = buzzer:F/CM12P: BUZZER Source: Buerklin; OC_FARNELL: unknown; OC_NEWARK: unknown
SV1-SV3 = con-lstb:MA03-2: PIN HEADER; OC_FARNELL: unknown; OC_NEWARK: unknown
U$1 U$2 = AB_Voltage_converters_updated 29-07-2019:AB_LM2596_BUCK_CONVERTER
U$4-U$6 U$11 U$16 = AB_Right_angle_terminal_block:AB_RIGHT_TER_BLK_3PIN
U$9 U$15 U$23-U$26 = AB_ plated drill 160 mil:AB_PLATED_DRILL_160MIL
U$10 = AB_Star_GND:AB_JOINT_GND
U$17-U$20 = AB_7805_FLAT:AB_7805_FLAT
U$29 = AB_ARDUINO_USB_HOST_SHIELD_updated 29-07-2019:AB_USB_HOST_SHIELD_ARDUINO
ULN = ic-package:DIL16: Dual In Line / Socket

## Net classes
1 arduino: width 0.305 mm, drill 0.33 mm, clearance 0.305 mm
2 signal: width 0.305 mm, drill 0.33 mm, clearance 0.305 mm to class 0, clearance 0.305 mm
3 signal-1: width 0.508 mm, drill 0.381 mm, clearance 0.305 mm to class 0, clearance 0.305 mm to class 1, clearance 0.305 mm to class 2, clearance 0.305 mm
4 signal-2: width 0.305 mm, drill 0.381 mm, clearance 0.305 mm to class 0, clearance 0.305 mm to class 1, clearance 0.305 mm to class 2, clearance 0.305 mm to class 3, clearance 0.305 mm
5 signal-3: width 0.508 mm, drill 0.381 mm, clearance 0.305 mm to class 0, clearance 0.305 mm to class 1, clearance 0.305 mm to class 2, clearance 0.305 mm to class 3, clearance 0.305 mm to class 4, clearance 0.305 mm
6 5v: width 1.016 mm, drill 0.406 mm, clearance 0.305 mm to class 0, clearance 0.305 mm to class 1, clearance 0.305 mm to class 2, clearance 0.305 mm to class 3, clearance 0.305 mm to class 4, clearance 0.305 mm to class 5, clearance 0.305 mm
7 odrive: width 5.08 mm, drill 0.483 mm, clearance 0.305 mm
8 nrf: width 0.305 mm, drill 0.33 mm, clearance 0.305 mm